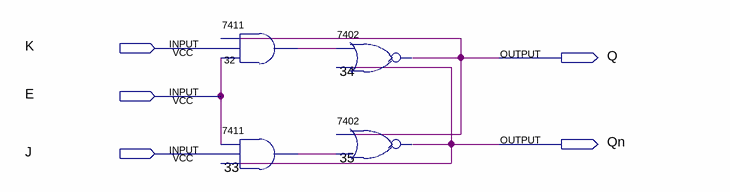
[diagram p0: schematic sheet]
// Quartus schematic Problem7.bdf as structural Verilog: 4 symbols, 5 pins
module Problem7 (
  input  K,
  input  E,
  input  J,
  output Q,
  output Qn
);

  wire n32_1, n33_1;

  \7411  u_32 (.\2 (Q), .\3 (K), .\4 (E), .\1 (n32_1));
  \7411  u_33 (.\2 (E), .\3 (J), .\4 (Qn), .\1 (n33_1));
  \7402  u_34 (.\2 (n32_1), .\3 (Qn), .\1 (Q));
  \7402  u_35 (.\2 (Q), .\3 (n33_1), .\1 (Qn));
endmodule
